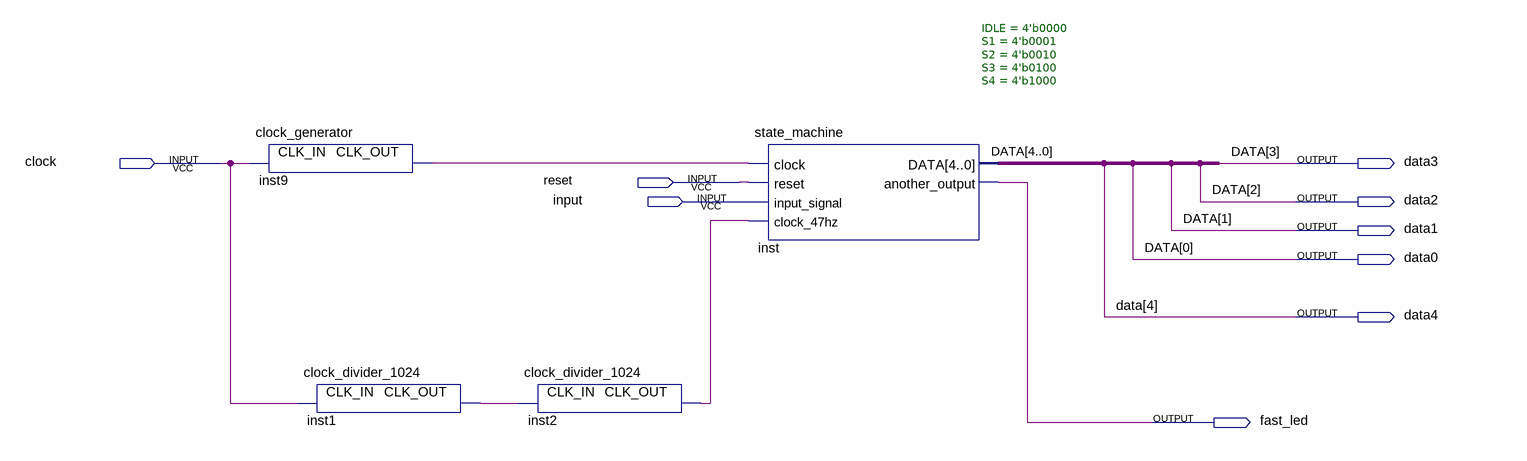
[diagram p0: schematic sheet]
// Quartus schematic state_machine_file.bdf as structural Verilog: 4 symbols, 9 pins
module state_machine_file (
  input  clock,
  input  reset,
  input  \input ,
  output data3,
  output data2,
  output data1,
  output data0,
  output data4,
  output fast_led
);

  wire inst1_clk_out, inst2_clk_out, inst9_clk_out;

  clock_generator inst9 (.CLK_IN(clock), .CLK_OUT(inst9_clk_out));
  clock_divider_1024 inst1 (.CLK_IN(clock), .CLK_OUT(inst1_clk_out));
  clock_divider_1024 inst2 (.CLK_IN(inst1_clk_out), .CLK_OUT(inst2_clk_out));
  state_machine #(.IDLE(4'b0000), .S1(4'b0001), .S2(4'b0010), .S3(4'b0100), .S4(4'b1000)) inst (
    .clock(inst9_clk_out), .reset(reset), .input_signal(\input ), .clock_47hz(inst2_clk_out),
    .DATA({data4, data3, data2, data1, data0}), .another_output(fast_led));
endmodule
